# Altium schematic sheet lm27313_5_12.SchDoc
size A4
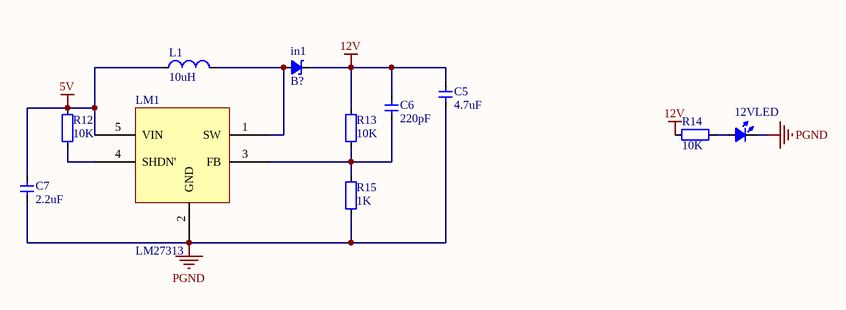
[diagram p0: lm27313_5_12.SchDoc]

## Parts
12VLED  LED_0805  [LED_0805_GREEN]  (value not drawn)
C5  value 4.7uF  [CAP_0603]  (hidden comment: Cap_0603)
C6  value 220pF  [CAP_0603]  (hidden comment: Cap_0603)
C7  value 2.2uF  [CAP_0603]  (hidden comment: Cap_0603)
in1  value B?  [SOD-123]  (hidden comment: SchottkyDiode_SOD123)
L1  value 10uH  [indmm5x2_2_2]
LM1  LM27313  [SOT23-5]
R12  value 10K  [RES_0603]  (hidden comment: Res_0603)
R13  value 10K  [RES_0603]  (hidden comment: Res_0603)
R14  value 10K  [RES_0603]  (hidden comment: Res_0603)
R15  value 1K  [RES_0603]  (hidden comment: Res_0603)

## Nets
5V: C7.2 L1.1 LM1.5(VIN) R12.2
12V: C5.2 C6.2 in1.2(K) R13.2 R14.1
PGND: 12VLED.2(K) C5.1 C7.1 LM1.2(GND) R15.1
Net12VLED_1: 12VLED.1(A) R14.2
NetC6_1: C6.1 LM1.3(FB) R13.1 R15.2
Netin1_1: in1.1(A) L1.2 LM1.1(SW)
NetLM1_4: LM1.4(SHDN') R12.1

## Library data of the parts
12VLED = LED_0603: LED
C5-C7 = Cap_0603: Capacitor
in1 = SchottkyDiode_SOD123: Diode
L1 = Ind_0603: Inductor
R12-R15 = Res_0603: Resistor